# EAGLE design Bryan (EAGLE 6.4)
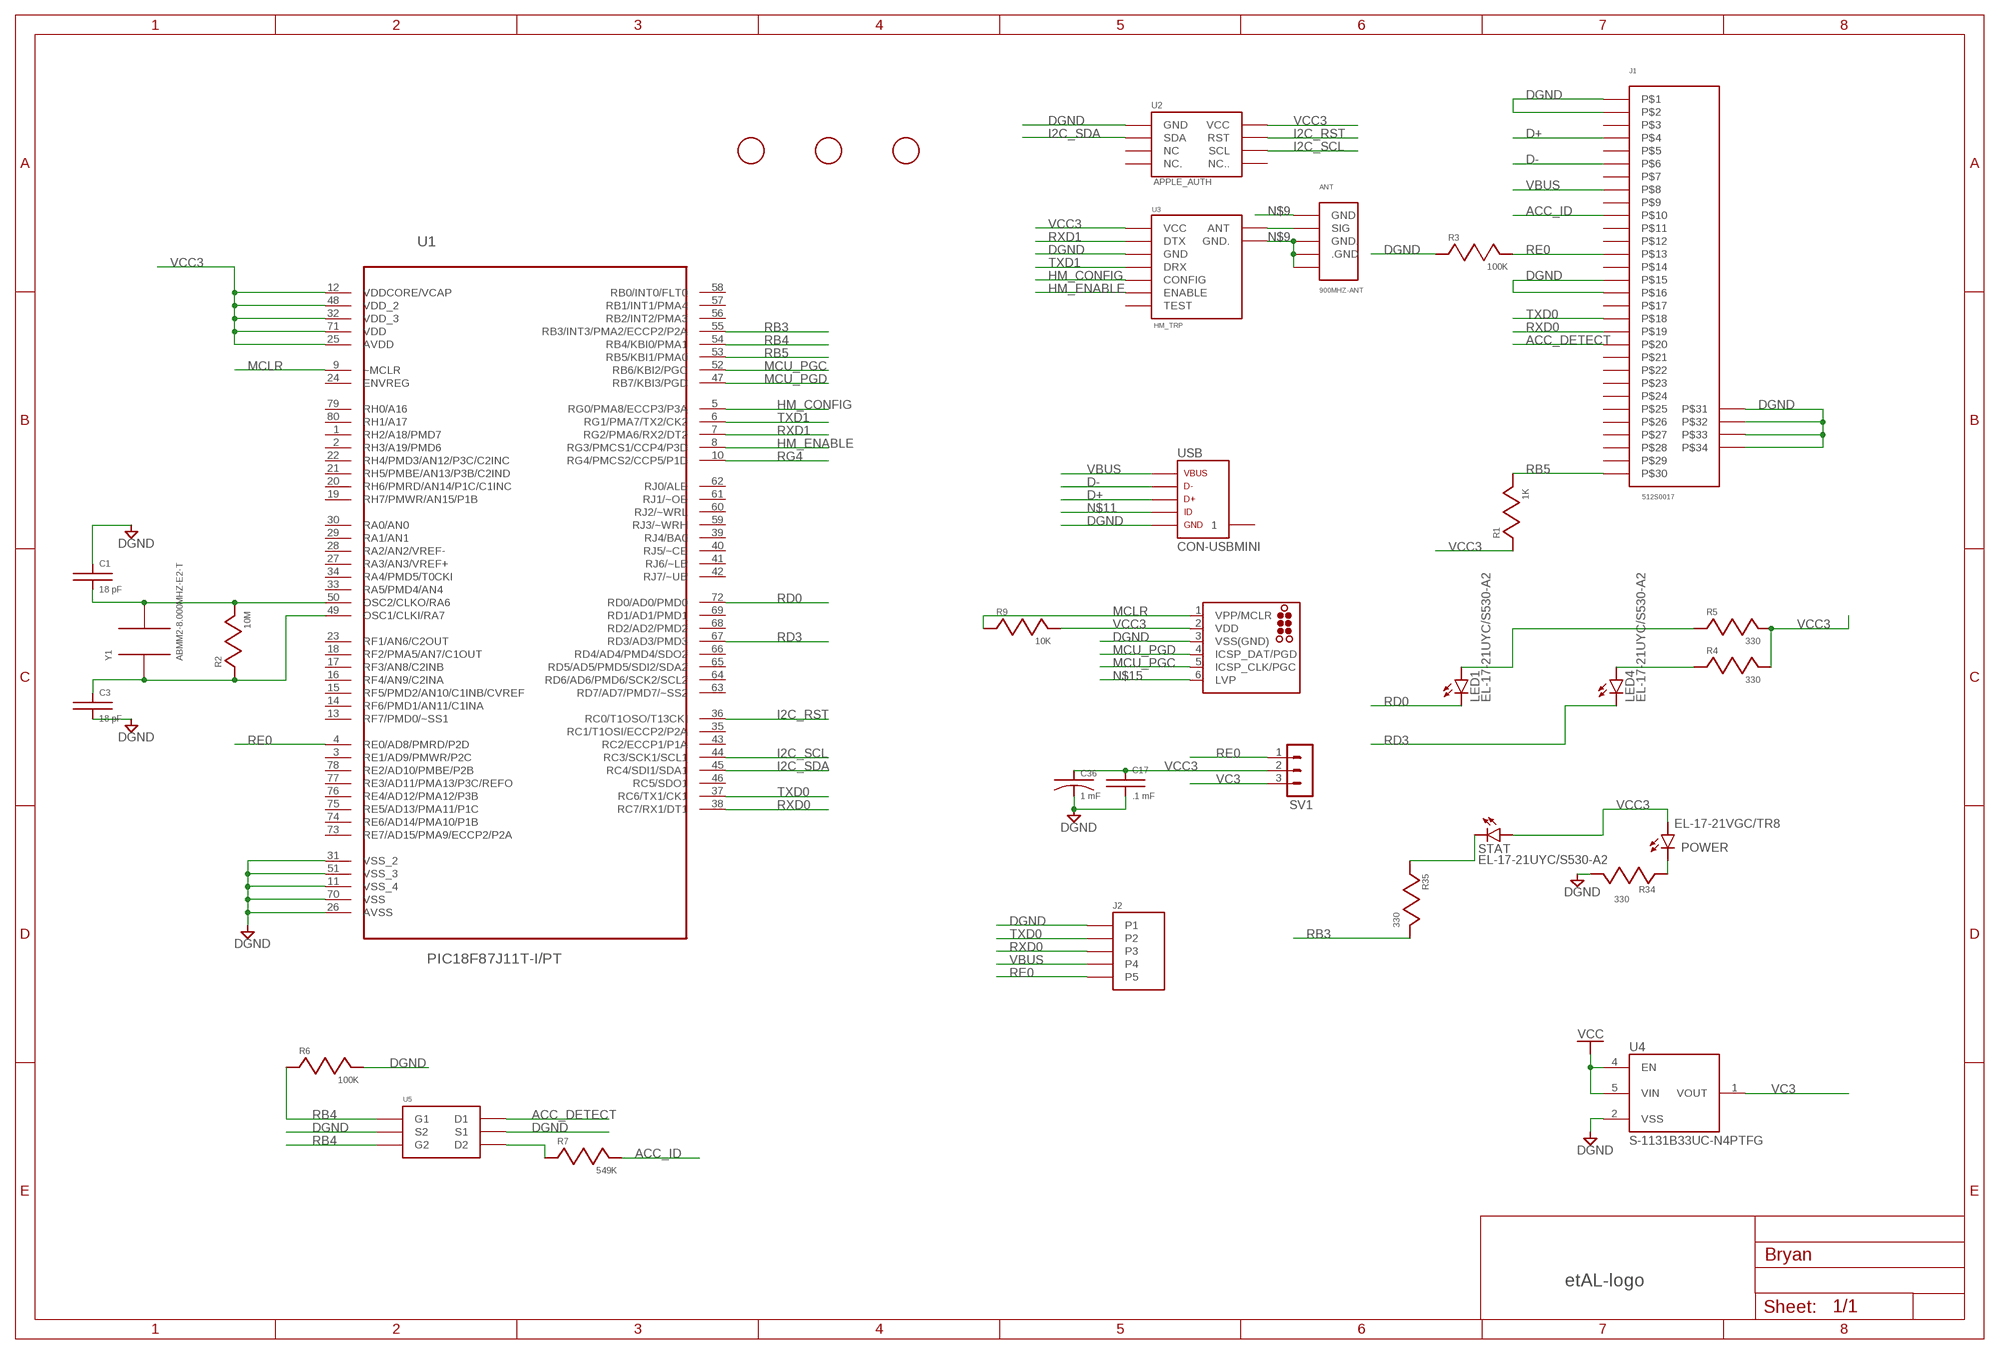
[diagram p0: schematic, sheet 1]

## Parts
ANT  900MHZ-ANT  [900MHZ-ANT]
C1  18 pF  C  [0603]
C3  18 pF  C  [0603]
C17  .1 mF  C  [0603]
C36  1 mF  C-POLAR1206  [1206-LONG]
J1  512S0017  [512S0017]
J2  LIGHTNING_C11  [LIGHTNING_C11]
J3  TC2030-MCP  [TC2030-MCP]
LED1  EL-17-21UYC/S530-A2  LED  [DIODE-0804]
LED4  EL-17-21UYC/S530-A2  LED  [DIODE-0804]
POWER  EL-17-21VGC/TR8  LED  [DIODE-0804]
R1  1K  R  [0603]
R2  10M  R  [0603]
R3  100K  R  [0603]
R4  330  R  [0603]
R5  330  R  [0603]
R6  100K  R  [0603]
R7  549K  R  [0603]
R9  10K  R  [0603]
R34  330  R  [0603]
R35  330  R  [0603]
STAT  EL-17-21UYC/S530-A2  LED  [DIODE-0804]
SV1  MA03-1  [MA03-1]
U1  PIC18F87J11T-I/PT  [QFP50P1400X1400X120-80N]
U2  APPLE_AUTH  [APPLE_AUTH]
U3  HM_TRP  [HM-TRP]
U4  S-1131B33UC-N4PTFG  S1131  [SOT-89-5]
U5  FDC6301N  [SUPER_SOT_6]
U$1  FIDUCIAL  [FIDUCIAL]
U$2  ETAL-LOGO  [ETAL-LOGO]
U$3  FIDUCIAL  [FIDUCIAL]
U$4  FIDUCIAL  [FIDUCIAL]
USB  CON-USBMINI  [USBMINI]
Y1  ABMM2-8.000MHZ-E2-T  CRYSTAL-ABMM  [CRYSTAL-6X3]

## Nets
ACC_DETECT: J1.P$20 U5.P$6(D1)
ACC_ID: J1.P$10 R7.2
D+: J1.P$4 USB.D+
D-: J1.P$6 USB.D-
DGND [POWER]: C1.1 C3.2 C17.2 C36.1(ANODE) J1.P$1 J1.P$2 J1.P$15 J1.P$16 J1.P$31 J1.P$32 J1.P$33 J1.P$34 J2.P1 J3.3(VSS(GND)) R3.1 R6.2 R34.2 U1.11(VSS_4) U1.26(AVSS) U1.31(VSS_2) U1.51(VSS_3) U1.70(VSS) U2.P$1(GND) U3.P3(GND) U4.2(VSS) U5.P$2(S2) U5.P$5(S1) USB.GND
HM_CONFIG: U1.5(RG0/PMA8/ECCP3/P3A) U3.P5(CONFIG)
HM_ENABLE: U1.8(RG3/PMCS1/CCP4/P3D) U3.P6(ENABLE)
I2C_RST: U1.36(RC0/T1OSO/T13CKI) U2.P$7(RST)
I2C_SCL: U1.44(RC3/SCK1/SCL1) U2.P$6(SCL)
I2C_SDA: U1.45(RC4/SDI1/SDA1) U2.P$2(SDA)
MCLR: J3.1(VPP/MCLR) R9.1 U1.9(~MCLR)
MCU_PGC: J3.5(ICSP_CLK/PGC) U1.52(RB6/KBI2/PGC)
MCU_PGD: J3.4(ICSP_DAT/PGD) U1.47(RB7/KBI3/PGD)
N$1 [extpwr]: ANT.P$2(SIG) U3.P9(ANT)
N$2: C1.2 R2.2 U1.50(OSC2/CLKO/RA6) Y1.P$3
N$3: LED1.CATHODE R5.1
N$4: C3.1 R2.1 U1.49(OSC1/CLKI/RA7) Y1.P$1
N$5: R35.1 STAT.ANODE
N$6: LED4.CATHODE R4.1
N$7: R7.1 U5.P$4(D2)
N$8: POWER.ANODE R34.1
N$9: ANT.P$1(.GND) ANT.P$3(GND.) ANT.P$4(GND) ANT.P$5 U3.P8(GND.)
N$11: USB.ID
N$15: J3.6(LVP)
RB3: R35.2 U1.55(RB3/INT3/PMA2/ECCP2/P2A)
RB4: R6.1 U1.54(RB4/KBI0/PMA1) U5.P$1(G1) U5.P$3(G2)
RB5: J1.P$30 R1.2 U1.53(RB5/KBI1/PMA0)
RD0: LED1.ANODE U1.72(RD0/AD0/PMD0)
RD3: LED4.ANODE U1.67(RD3/AD3/PMD3)
RE0: J1.P$13 J2.P5 R3.2 SV1.1 U1.4(RE0/AD8/PMRD/P2D)
RG4: U1.10(RG4/PMCS2/CCP5/P1D)
RXD0: J1.P$19 J2.P3 U1.38(RC7/RX1/DT1)
RXD1: U1.7(RG2/PMA6/RX2/DT2) U3.P2(DTX)
TXD0: J1.P$18 J2.P2 U1.37(RC6/TX1/CK1)
TXD1: U1.6(RG1/PMA7/TX2/CK2) U3.P4(DRX)
VBUS: J1.P$8 J2.P4 USB.VBUS
VC3 [extpwr]: SV1.3 U4.1(VOUT)
VCC [POWER]: U4.4(EN) U4.5(VIN)
VCC3 [POWER]: C17.1 C36.2(CATHODE) J3.2(VDD) POWER.CATHODE R1.1 R4.2 R5.2 R9.2 STAT.CATHODE SV1.2 U1.12(VDDCORE/VCAP) U1.25(AVDD) U1.32(VDD_3) U1.48(VDD_2) U1.71(VDD) U2.P$8(VCC) U3.P1(VCC)
Unconnected: J1.P$3 J1.P$5 J1.P$7 J1.P$9 J1.P$11 J1.P$12 J1.P$14 J1.P$17 J1.P$21 J1.P$22 J1.P$23 J1.P$24 J1.P$25 J1.P$26 J1.P$27 J1.P$28 J1.P$29 U1.1(RH2/A18/PMD7) U1.2(RH3/A19/PMD6) U1.3(RE1/AD9/PMWR/P2C) U1.13(RF7/PMD0/~SS1) U1.14(RF6/PMD1/AN11/C1INA) U1.15(RF5/PMD2/AN10/C1INB/CVREF) U1.16(RF4/AN9/C2INA) U1.17(RF3/AN8/C2INB) U1.18(RF2/PMA5/AN7/C1OUT) U1.19(RH7/PMWR/AN15/P1B) U1.20(RH6/PMRD/AN14/P1C/C1INC) U1.21(RH5/PMBE/AN13/P3B/C2IND) U1.22(RH4/PMD3/AN12/P3C/C2INC) U1.23(RF1/AN6/C2OUT) U1.24(ENVREG) U1.27(RA3/AN3/VREF+) U1.28(RA2/AN2/VREF-) U1.29(RA1/AN1) U1.30(RA0/AN0) U1.33(RA5/PMD4/AN4) U1.34(RA4/PMD5/T0CKI) U1.35(RC1/T1OSI/ECCP2/P2A) U1.39(RJ4/BA0) U1.40(RJ5/~CE) U1.41(RJ6/~LB) U1.42(RJ7/~UB) U1.43(RC2/ECCP1/P1A) U1.46(RC5/SDO1) U1.56(RB2/INT2/PMA3) U1.57(RB1/INT1/PMA4) U1.58(RB0/INT0/FLT0) U1.59(RJ3/~WRH) U1.60(RJ2/~WRL) U1.61(RJ1/~OE) U1.62(RJ0/ALE) U1.63(RD7/AD7/PMD7/~SS2) U1.64(RD6/AD6/PMD6/SCK2/SCL2) U1.65(RD5/AD5/PMD5/SDI2/SDA2) U1.66(RD4/AD4/PMD4/SDO2) U1.68(RD2/AD2/PMD2) U1.69(RD1/AD1/PMD1) U1.73(RE7/AD15/PMA9/ECCP2/P2A) U1.74(RE6/AD14/PMA10/P1B) U1.75(RE5/AD13/PMA11/P1C) U1.76(RE4/AD12/PMA12/P3B) U1.77(RE3/AD11/PMA13/P3C/REFO) U1.78(RE2/AD10/PMBE/P2B) U1.79(RH0/A16) U1.80(RH1/A17) U2.P$3(NC) U2.P$4(NC.) U2.P$5(NC..) U3.P7(TEST) USB.P$1

## Library data of the parts
ANT = bgsystems:900MHZ-ANT
C1 C3 C17 = bgsystems:C: CAPACITOR
C36 = bgsystems:C-POLAR
J1 = bgsystems:512S0017
J2 = bgsystems:LIGHTNING_C11
J3 = BrandWatch:TC2030: TAG-CONNECT ISP Connector Manufacturer: Tag-Connect <www.tag-connect.com> Cable for easy In-Circuit PCB Programming. Designed for Microchip ICD2, suitable for many others. Two variants - one "with legs" (for hads-free fit on PCB) and another "without legs" for quick programming. PAD Description 1 MCLR/Vpp 2 Vdd 3 GND 4 PGD (ISPDAT) 5 PGC (ISPCLK) 6 nc (used for LVP) ©2009 ROFA.cz
LED1 LED4 POWER STAT = bgsystems:LED: LED - Kingbright SUPER FLUX LED LAMP Source: www.us.kingbright.com/images/catalog/SPEC/W7676CPBC-H.pdf
R1-R7 R9 R34 R35 = bgsystems:R
SV1 = con-lstb:MA03-1: PIN HEADER; OC_FARNELL: unknown; OC_NEWARK: unknown
U1 = microchip_1:PIC18F87J11T-I/PT: IC PIC MCU; MPN: PIC18F87J11T-I/PT; OC_FARNELL: 1439570; OC_NEWARK: 59M1138; PACKAGE: QFP-80; SUPPLIER: Microchip
U2 = bgsystems:APPLE_AUTH
U3 = bgsystems:HM_TRP
U4 = bgsystems:S1131
U5 = bgsystems:FDC6301N
U$1 U$3 U$4 = bgsystems:FIDUCIAL
U$2 = bgsystems:ETAL-LOGO
USB = bgsystems:CON-USBMINI
Y1 = bgsystems:CRYSTAL-ABMM

## Net classes
0 default: width 0.203 mm
1 POWER: width 0.203 mm
2 ADC: width 0.203 mm
3 extpwr: width 0.889 mm
4 AGND: width 0.356 mm

## Board
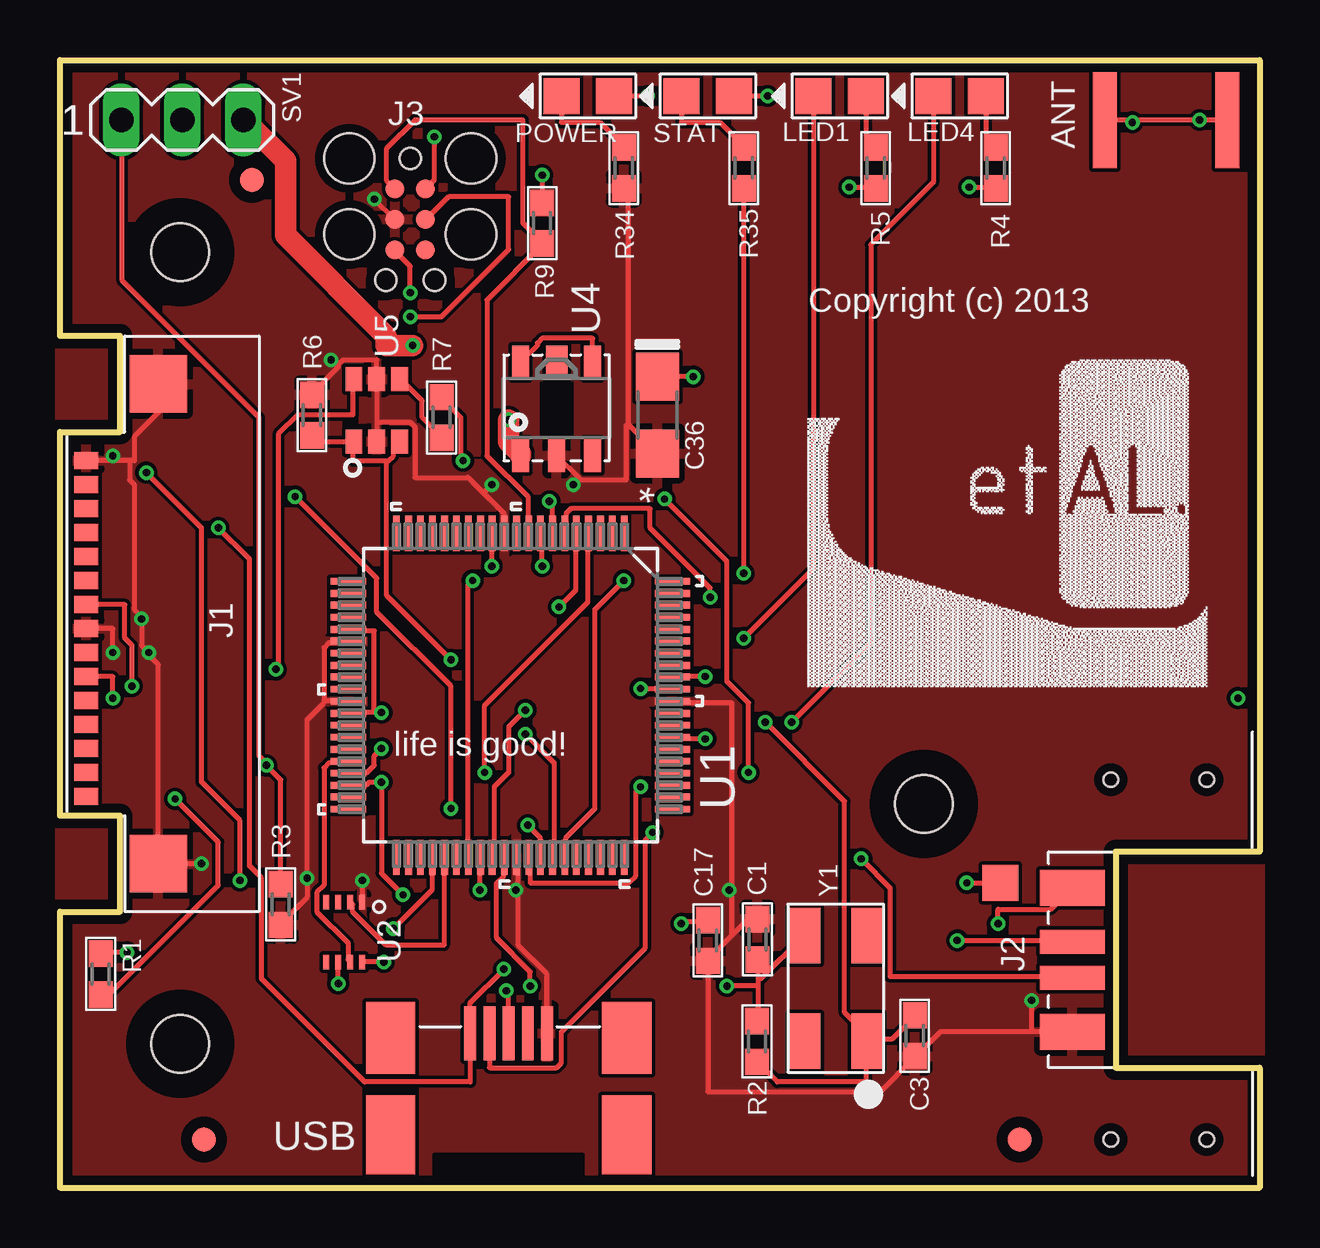
[diagram p1: board, top side]
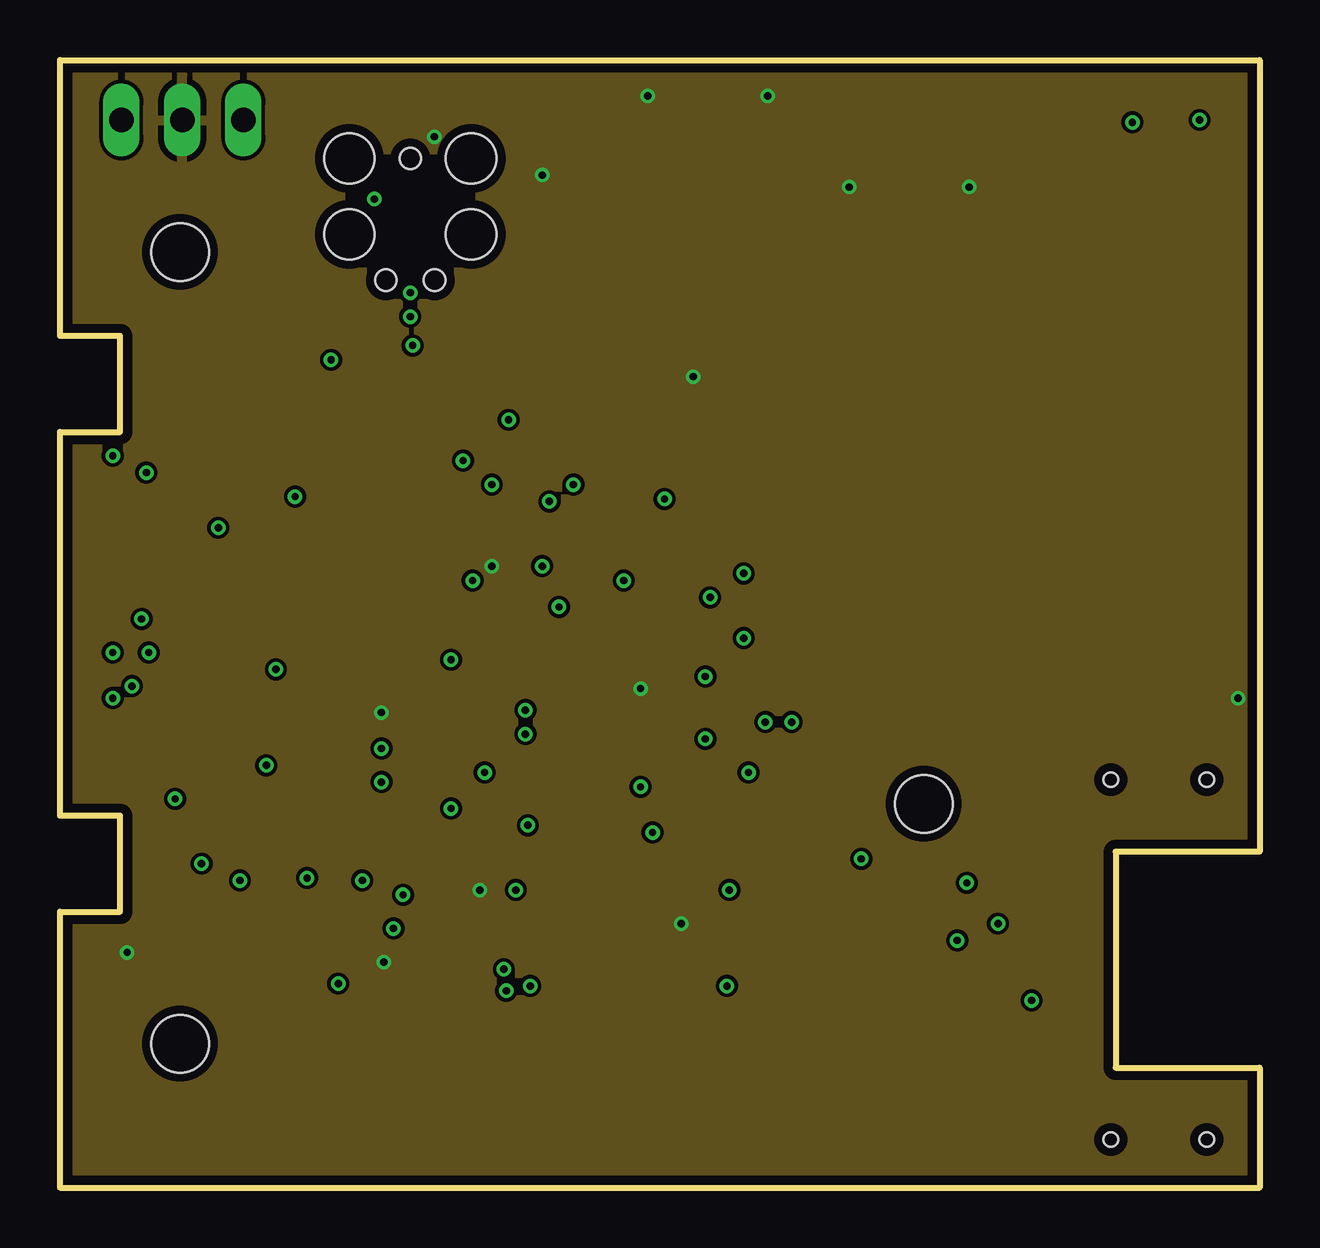
[diagram p2: board, inner layer PWR]
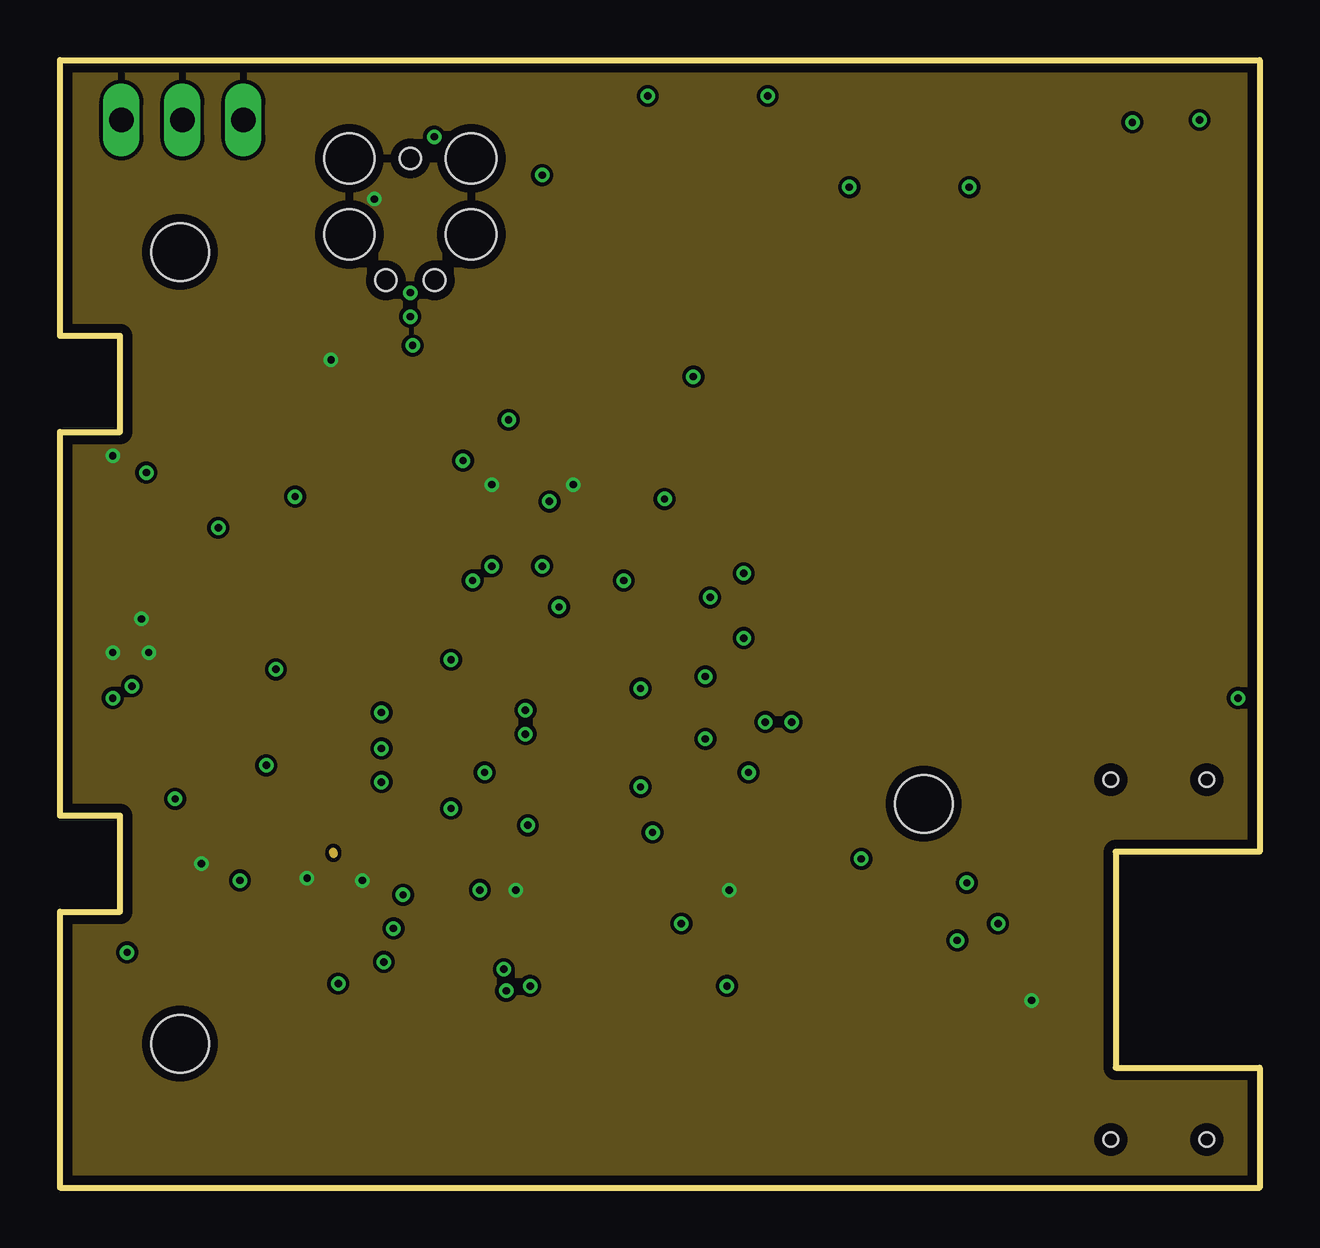
[diagram p3: board, inner layer GND]
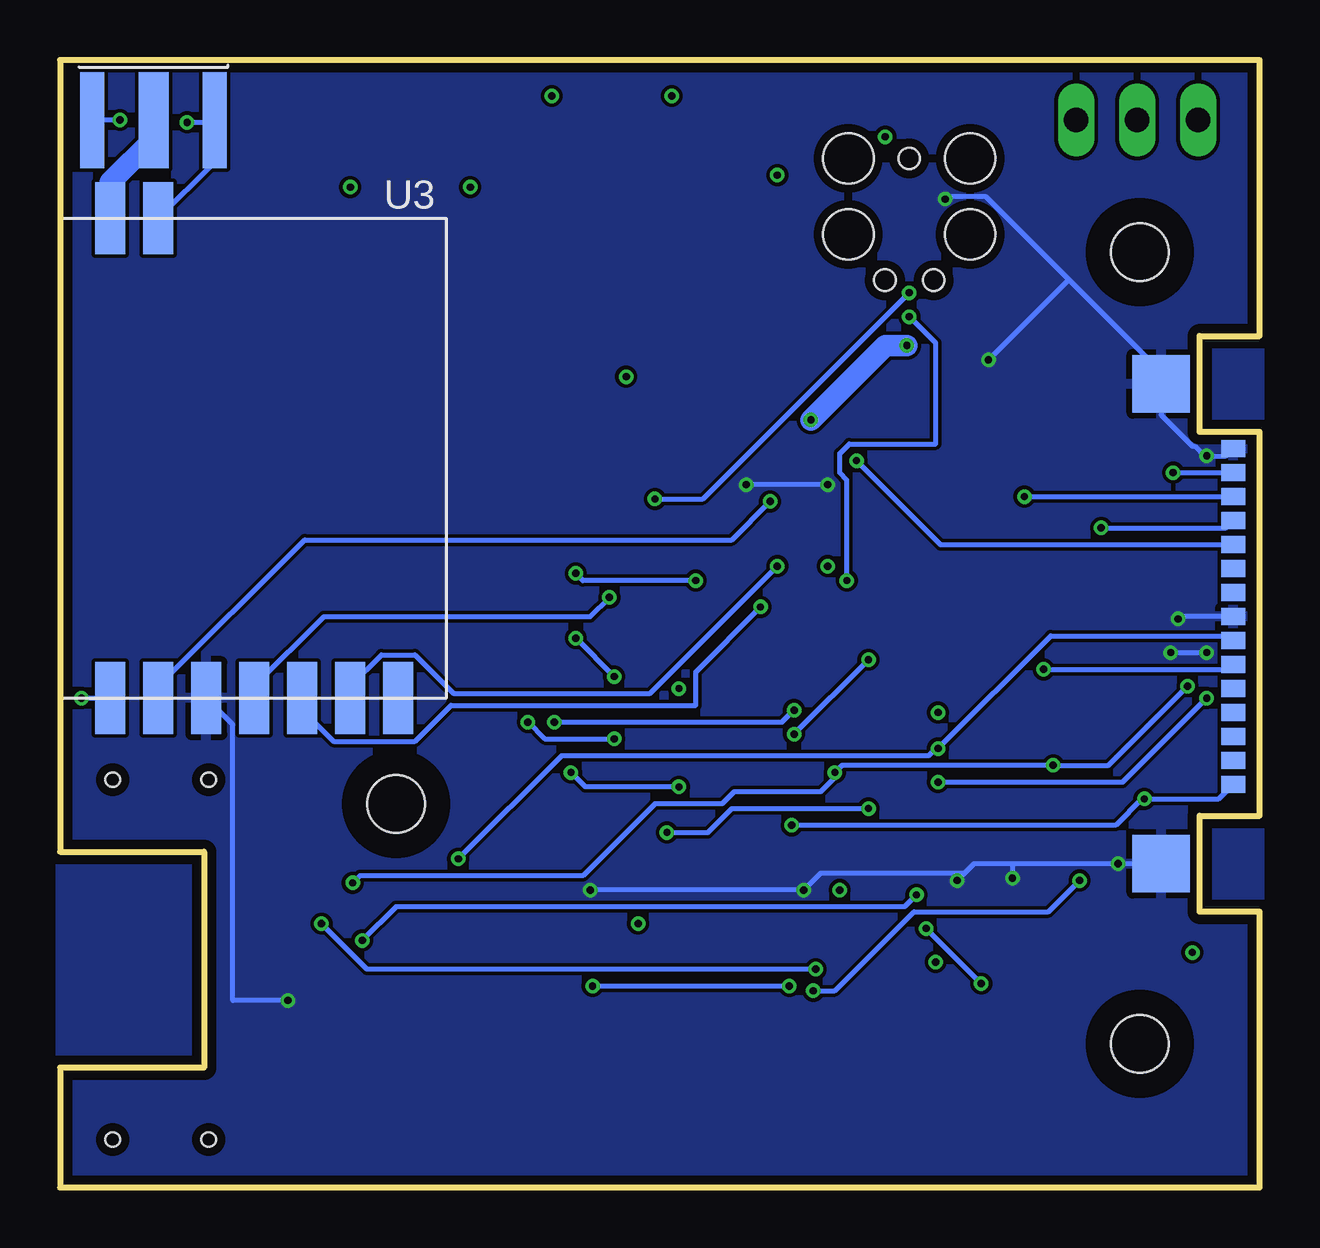
[diagram p4: board, bottom side, seen from below]

Size 50 x 47 mm. Coordinates in mm from the lower left corner, seen from the top.
Outline: 0,0 50,0 50,5 44,5 44,14 50,14 50,47 0,47 0,35.5 2.5,35.5 2.5,31.5 0,31.5 0,15.5 2.5,15.5 2.5,11.5 0,11.5 0,0
Copper layers (1*3+14*16): Top 0.035mm / dielectric 0.2mm / PWR 0.035mm / dielectric 0.2mm / GND 0.035mm / dielectric 0.15mm / Bottom 0.035mm
Design rules "default": minimum track width 8mil, minimum drill 12mil, track to track 6mil, track to pad 6mil, pad to pad 6mil, via to via 10mil, smd to smd 5mil, copper to edge 15mil, drill to drill 7mil, minimum pad ring 0.25mm, minimum via ring 0.15mm, stop-mask expansion 0.1mm, vias tented up to drill 24mil, thermal gap 0.25mm
Holes 2.4 mm at 36,16 5,6 5,39
tRestrict: area 54.2,25.3 to 58.1,29.2; area 63.1,41.6 to 67.1,45.6; area 53.1,9.6 to 57.1,13.6; area 3.2,37.2 to 6.8,40.8; area 3.2,4.2 to 6.8,7.8; area 34.2,14.2 to 37.8,17.8
bRestrict: area 56.1,30.2 to 60.2,34.3; area 72.1,37.6 to 76.1,41.6; area 53.1,17.6 to 57.1,21.6; area 3.2,37.2 to 6.8,40.8; area 3.2,4.2 to 6.8,7.8; area 34.2,14.2 to 37.8,17.8

### Footprints (pad centres in the part's own frame; a part is rotated, then mirrored left to right if it is on the bottom)
900MHZ-ANT = smd 1 x 4: P$1 -2.55,0; P$3 2.55,0 | smd 1.25 x 4: P$2 0,0 | smd 1 x 4 bottom: P$4 -2.55,0; P$5 2.55,0
0603 = smd 1.1 x 1: 1 -0.85,0; 2 0.85,0
1206-LONG = smd 2 x 1.8: 1 -1.6,0; 2 1.6,0
512S0017 = smd 0.7 x 1: P$1 -6.8,0.8; P$3 -5.8,0.8; P$5 -4.8,0.8; P$7 -3.8,0.8; P$9 -2.8,0.8; P$11 -1.8,0.8; P$13 -0.8,0.8; P$15 0.2,0.8; P$17 1.2,0.8; P$19 2.2,0.8; P$21 3.2,0.8; P$23 4.2,0.8; P$25 5.2,0.8; P$27 6.2,0.8; P$29 7.2,0.8 | smd 0.7 x 1 bottom: P$2 -7.3,0.8; P$4 -6.3,0.8; P$6 -5.3,0.8; P$8 -4.3,0.8; P$10 -3.3,0.8; P$12 -2.3,0.8; P$14 -1.3,0.8; P$16 -0.3,0.8; P$18 0.7,0.8; P$20 1.7,0.8; P$22 2.7,0.8; P$24 3.7,0.8; P$26 4.7,0.8; P$28 5.7,0.8; P$30 6.7,0.8 | smd 2.4 x 2.4: P$31 10,3.8; P$32 -10,3.8 | smd 2.4 x 2.4 bottom: P$33 -10,3.8; P$34 10,3.8
LIGHTNING_C11 = smd 1.5 x 2.7: P1 3,1; P4 -3,1 | smd 1 x 2.7: P2 0.75,1; P3 -0.75,1 | smd 1.5 x 1.5: P5 -3.2,-2 | hole 0.6: -7.5,6.6; -7.5,2.6; 7.5,6.6; 7.5,2.6
TC2030-MCP = smd 0.787 x 0.787: 1 1.27,-0.635; 2 1.27,0.635; 3 2.54,-0.635; 4 2.54,0.635; 5 3.81,-0.635; 6 3.81,0.635 | hole 0.889: 0,0; 5.08,-1.016; 5.08,1.016 | hole 2.1: 0,2.54; 0,-2.54; 3.175,-2.54; 3.175,2.54
DIODE-0804 = smd 1.5 x 1.5: ANODE -1.1,0; CATHODE 1.1,0
MA03-1 = drill 1.016 long: 1 -2.54,0; 2 0,0; 3 2.54,0
QFP50P1400X1400X120-80N = smd 1.473 x 0.279: 1 -6.756,4.75; 2 -6.756,4.242; 3 -6.756,3.759; 4 -6.756,3.251; 5 -6.756,2.743; 6 -6.756,2.261; 7 -6.756,1.753; 8 -6.756,1.245; 9 -6.756,0.762; 10 -6.756,0.254; 11 -6.756,-0.254; 12 -6.756,-0.762; 13 -6.756,-1.245; 14 -6.756,-1.753; 15 -6.756,-2.261; 16 -6.756,-2.743; 17 -6.756,-3.251; 18 -6.756,-3.759; 19 -6.756,-4.242; 20 -6.756,-4.75; 41 6.756,-4.75; 42 6.756,-4.242; 43 6.756,-3.759; 44 6.756,-3.251; 45 6.756,-2.743; 46 6.756,-2.261; 47 6.756,-1.753; 48 6.756,-1.245; 49 6.756,-0.762; 50 6.756,-0.254; 51 6.756,0.254; 52 6.756,0.762; 53 6.756,1.245; 54 6.756,1.753; 55 6.756,2.261; 56 6.756,2.743; 57 6.756,3.251; 58 6.756,3.759; 59 6.756,4.242; 60 6.756,4.75 | smd 0.279 x 1.473: 21 -4.75,-6.756; 22 -4.242,-6.756; 23 -3.759,-6.756; 24 -3.251,-6.756; 25 -2.743,-6.756; 26 -2.261,-6.756; 27 -1.753,-6.756; 28 -1.245,-6.756; 29 -0.762,-6.756; 30 -0.254,-6.756; 31 0.254,-6.756; 32 0.762,-6.756; 33 1.245,-6.756; 34 1.753,-6.756; 35 2.261,-6.756; 36 2.743,-6.756; 37 3.251,-6.756; 38 3.759,-6.756; 39 4.242,-6.756; 40 4.75,-6.756; 61 4.75,6.756; 62 4.242,6.756; 63 3.759,6.756; 64 3.251,6.756; 65 2.743,6.756; 66 2.261,6.756; 67 1.753,6.756; 68 1.245,6.756; 69 0.762,6.756; 70 0.254,6.756; 71 -0.254,6.756; 72 -0.762,6.756; 73 -1.245,6.756; 74 -1.753,6.756; 75 -2.261,6.756; 76 -2.743,6.756; 77 -3.251,6.756; 78 -3.759,6.756; 79 -4.242,6.756; 80 -4.75,6.756
APPLE_AUTH = smd 0.25 x 0.6: P$1 -0.7,-1.2; P$2 -0.2,-1.2; P$3 0.3,-1.2; P$4 0.8,-1.2; P$5 0.8,1.3; P$6 0.3,1.3; P$7 -0.2,1.3; P$8 -0.7,1.3
HM-TRP = smd 1.25 x 3: P1 2,0; P2 4,0; P3 6,0; P4 8,0; P5 10,0; P6 12,0; P7 14,0; P8 4,20; P9 2,20
SOT-89-5 = smd 0.7 x 1.4: 1 -1.499,-1.981; 2 0,-1.981; 3 1.499,-1.981; 4 1.5,1.9; 5 -1.5,1.9 | smd 0.9 x 1.4: 2.1 0,1.9
SUPER_SOT_6 = smd 0.7 x 1: P$1 -0.95,-1.3; P$2 0,-1.3; P$3 0.95,-1.3; P$4 0.95,1.3; P$5 0,1.3; P$6 -0.95,1.3
FIDUCIAL = smd 1 x 1: P$1 0,0
USBMINI = smd 2.25 x 0.5: D+ 6.225,0; D- 6.225,0.8; GND 6.225,-1.6; ID 6.225,-0.8; VBUS 6.225,1.6 | smd 3 x 2.05: P$1 6.05,-4.925; P$2 6.05,4.925 | smd 3.3 x 2.05: P$3 2,4.925; P$4 2,-4.925
CRYSTAL-6X3 = smd 2.3 x 1.3: P$1 -2.2,-1.3; P$2 2.2,-1.3; P$3 2.2,1.3; P$4 -2.2,1.3

### Placement (x,y rotation side)
ANT  46.1,44.5 0 bottom
C1  29.07,10.35 270 top
C3  35.63,6.33 270 top
C17  27,10.3 270 top
C36  24.9,32.2 90 top
J1  0.3,23.5 270 top
J2  41.2,9.5 270 top
J3  14.6,42.9 270 top
LED1  32.5,45.5 0 top
LED4  37.5,45.5 0 top
POWER  22,45.5 0 top
R1  1.7,8.9 270 top
R2  29.05,6.09 90 top
R3  9.2,11.8 90 top
R4  39,42.5 270 top
R5  34,42.5 270 top
R6  10.5,32.2 90 top
R7  15.9,32.1 90 top
R9  20.1,40.2 90 top
R34  23.5,42.5 270 top
R35  28.5,42.5 270 top
STAT  27,45.5 0 top
SV1  5.1,44.5 0 top
U1  18.78,20.52 270 top
U2  11.9,10.7 180 top
U3  49.9,20.4 0 bottom
U4  20.7,32.5 0 top
U5  13.2,32.4 0 top
U$1  8,42 0 top
U$2  31.2,20.9 0 top
U$3  6,2 0 top
U$4  40,2 0 top
USB  18.7,0.2 90 top
Y1  32.34,8.3 90 top

### Tracks (layer width: path | path; a pad name or v marks a point on that pad's centre or on a via)
ACC_DETECT  (via drill 0.3)
  Top 0.203: v9,21.6 9.1,21.7 9.1,31.4 9.9,32.2 12.2,32.2 12.2,33.7 U5.P$6
  Bottom 0.203: J1.P$20 1.3,21.6 v9,21.6
ACC_ID  (via drill 0.3)
  Top 0.203: v16.8,30.3 16.7,30.4 16.7,32.1 15.9,32.9 R7.2
  Bottom 0.203: J1.P$10 13.3,26.8 v16.8,30.3
AGND
  GND 0.356: 11.4,13.9 11.39,14
D+  (via drill 0.3)
  Top 0.203: v3.6,29.8 5.9,27.5 5.9,16.9 7.5,15.3 v7.5,12.8 | v18.6,8.2 18.7,8.1 USB.D+
  Bottom 0.203: v3.6,29.8 J1.P$4 | v7.5,12.8 8.8,11.5 14.4,11.5 17.7,8.2 v18.6,8.2
D-  (via drill 0.3)
  Top 0.203: v9.8,28.8 13.2,25.4 13.2,24 16.3,20.9 v16.3,15.8 | v24.7,14.8 24.4,14.5 24.4,10 20.9,6.5 20.9,5.2 20.7,5 17.9,5 USB.D-
  Bottom 0.203: v9.8,28.8 J1.P$6 | v16.3,15.8 22,15.8 23,14.8 v24.7,14.8
DGND  (via drill 0.3)
  Top 0.203: 23.7,31.8 23.7,41.4 23.5,41.6 R34.2 | C36.1 23.7,31.8 | 21.65,29.55 21.7,29.5 23.6,29.5 23.6,31.8 23.7,31.8 | 21.65,29.55 20.7,30.5 U4.2 | J1.P$15 2.2,23.3 v2.2,22.3 | 2.9,30.3 3.1,30.3 3.1,31.3 4.1,32.3 J1.P$33 | 2.9,30.3 2.2,30.3 | 2.2,30.3 J1.P$1 | v2.2,30.5 2.2,30.3 | 2.9,30.3 2.9,29.5 3.1,29.3 3.1,24.1 3.4,23.8 v3.4,23.7 3.4,22.6 v3.7,22.3 3.7,22.2 4.1,21.8 J1.P$34 v5.9,13.5 | 13.2,31.9 U5.P$5 13.2,34.5 11.8,34.5 11.6,34.3 | 13.2,31.9 U5.P$2 | 11.6,34.3 11.6,34.2 10.5,33.1 R6.2 | 17.65,28.95 17,29.6 14.8,29.6 14.8,31.7 14.6,31.9 13.2,31.9 | 17.65,28.95 18.5,28.1 18.5,27.3 U1.11 | v13.1,41.2 13.9,40.4 J3.3 | v11.3,34.5 11.5,34.3 11.6,34.3 | v21.4,29.3 21.65,29.55 | 17.65,28.95 v18,29.3 | J2.P1 40.5,6.5 | 40.5,6.5 36.7,6.5 35.7,5.5 C3.2 35.6,5.4 34.2,4 27,4 C17.2 27,9.5 28.05,10.55 | 40.5,6.5 v40.5,7.8 | 28.05,10.55 28.6,11.1 29,11.1 C1.1 | 28,12.4 28,10.6 28.05,10.55 | 28,12.4 28,20.2 25.6,20.2 U1.70 | 19.1,12.4 19.1,10.1 20.3,8.9 USB.GND | 19.1,12.4 19.1,13.7 U1.51 | 11,20.3 12,20.3 U1.31 | 11,20.3 11,22.5 11.2,22.7 12,22.7 U1.26 | v12.6,12.8 U2.P$1 | R3.1 9.2,11 10.3,12.1 v10.3,12.9 10.3,19.5 11,20.2 11,20.3 | v19,12.4 19.1,12.4 | v27.9,12.4 28,12.4
  Bottom 0.203: v3.7,22.3 v2.2,22.3 | v3.4,23.7 3.3,23.8 J1.P$16 | J1.P$2 1.4,30.5 v2.2,30.5 2.3,30.5 2.7,30.9 2.8,30.9 4.1,32.2 J1.P$33 4.1,34 7.95,37.85 | v13.1,41.2 13,41.3 11.4,41.3 7.95,37.85 | 7.95,37.85 v11.3,34.5 | v18,29.3 v21.4,29.3 | U3.P3 42.8,19.3 42.8,7.8 v40.5,7.8 | 12.35,13.05 11.9,13.5 10.3,13.5 | 12.35,13.05 v12.6,12.8 | J1.P$34 v5.9,13.5 10.3,13.5 | 10.3,13.5 v10.3,12.9 | 12.35,13.05 12.4,13.1 18.3,13.1 v19,12.4 v27.9,12.4
  pour GND (rank 5): 50,0 50,47 -0.17,47 0,32.5 0.31,7.97 0,0
  pour Top: 0,0 0,47 50,47 50,0
  pour Bottom: 0,0 0,47 50,47 50,0
HM_CONFIG  (via drill 0.3)
  Top 0.203: v20.8,24.2 21.5,24.9 21.5,27.2 U1.5
  Bottom 0.203: v20.8,24.2 23.5,21.5 23.5,20.1 33.7,20.1 35.2,18.6 38.6,18.6 39.9,19.9 U3.P5
HM_ENABLE  (via drill 0.3)
  Top 0.203: v20.1,25.9 20.1,27.2 U1.8
  Bottom 0.203: v20.1,25.9 25.4,20.6 33.6,20.6 35.2,22.2 36.6,22.2 37.9,20.9 U3.P6
I2C_RST
  Top 0.203: U2.P$7 12,9.5 12,10.2 10.7,11.5 10.7,12.3 11,12.6 11,17.5 11.2,17.7 12,17.7 U1.36
I2C_SCL  (via drill 0.3)
  Top 0.203: v11.6,8.5 U2.P$6 | v13.9,10.8 15.5,12.4 15.5,13.7 U1.44
  Bottom 0.203: v13.9,10.8 v11.6,8.5
I2C_SDA
  Top 0.203: U2.P$2 12.2,11.8 12.2,11.5 13.6,10.1 16,10.1 16,13.7 U1.45
MCLR
  Top 0.203: J3.1 13.9,41.7 13.6,42 13.6,43.3 14.8,44.5 19.3,44.5 19.3,40.2 20.1,39.4 R9.1 20.1,39.3 17.8,37 17.8,30.5 19.5,28.8 19.5,27.3 U1.9
MCU_PGC  (via drill 0.3)
  Top 0.203: v14.6,37.3 14.6,38.4 14,39 J3.5 | v25.2,28.7 27.8,26.1 27.8,21.1 28.7,20.2 v28.7,17.3 | v24.2,16.7 24,16.5 24,13 23.7,12.7 19.6,12.7 19.6,13.7 U1.52
  Bottom 0.203: v14.6,37.3 23.2,28.7 v25.2,28.7 | v28.7,17.3 28.1,16.7 v24.2,16.7
MCU_PGD  (via drill 0.3)
  Top 0.203: v14.6,36.3 15.9,36.3 18.7,39.1 18.7,41.3 16.2,41.3 15.3,40.4 J3.4 | v17.2,25.3 17,25.1 17,13.8 U1.47
  Bottom 0.203: v14.6,36.3 13.5,35.2 13.5,31 17.1,31 17.5,30.6 17.5,29.8 17.2,29.5 v17.2,25.3
N$1
  Bottom 0.889: U3.P9 47.9,41.9 46.1,43.7 ANT.P$2
N$2  (via drill 0.3)
  Top 0.203: 29.1,8.7 29.1,9.4 C1.2 | 29.1,8.7 29.1,8.4 | 29.1,8.4 29.1,7 R2.2 | v19.6,8.4 19.6,9 18.2,10.4 18.2,12.7 18.5,13 18.5,13.7 U1.50 | 29.1,8.4 v27.8,8.4 | Y1.P$3 31,10.5 29.2,8.7 29.1,8.7
  Bottom 0.203: v27.8,8.4 v19.6,8.4
N$3
  Top 0.203: LED1.CATHODE 33.6,43.8 34,43.4 R5.1
N$4  (via drill 0.3)
  Top 0.203: R2.1 29.1,5.2 29.9,4.4 33.6,4.4 33.6,6.1 Y1.P$1 | C3.1 35.6,7.1 34.7,6.2 33.7,6.2 Y1.P$1 | v19.4,19.9 18.7,19.2 18.7,17.3 18.1,16.7 18.1,13.8 U1.49 | v29.4,19.4 32.7,16.1 32.7,7.3 33.7,6.3 Y1.P$1
  Bottom 0.203: v19.4,19.9 19.9,19.4 v29.4,19.4
N$5
  Top 0.203: STAT.ANODE 25.9,44.4 27.5,44.4 28.5,43.4 R35.1
N$6
  Top 0.203: LED4.CATHODE 38.6,43.8 39,43.4 R4.1
N$7
  Top 0.203: U5.P$4 14.2,33.7 15.1,32.8 15.1,32.1 15.9,31.3 R7.1
N$8
  Top 0.203: POWER.ANODE 20.9,44.4 22.5,44.4 23.5,43.4 R34.1
N$9  (via drill 0.3)
  Top 0.203: ANT.P$1 v47.5,44.5 44.7,44.5 | 44.7,44.5 ANT.P$5 | v44.7,44.4 44.7,44.5
  Bottom 0.203: U3.P8 43.6,42.7 43.6,44.5 ANT.P$5 43.7,44.4 v44.7,44.4 | v47.5,44.5 ANT.P$1
RB3  (via drill 0.3)
  Top 0.203: v28.5,25.6 R35.2 | v23.5,25.3 22.3,24.1 22.3,15.8 21.1,14.6 21.1,13.8 U1.55
  Bottom 0.203: v28.5,25.6 28.2,25.3 v23.5,25.3
RB4  (via drill 0.3)
  Top 0.203: R6.1 10.5,31.1 U5.P$1 12.2,31 12.2,30.3 13.6,30.3 | 13.6,30.3 13.7,30.3 13.9,30.5 13.9,30.9 14.1,31.1 U5.P$3 | v19.4,18.9 20.6,17.7 20.6,13.8 U1.54 | v16.3,22 13.6,24.7 13.6,30.3
  Bottom 0.203: v16.3,22 v19.4,18.9
RB5  (via drill 0.3)
  Top 0.203: v4.8,16.2 6.6,14.4 6.6,12.6 2.1,8.1 1.7,8.1 R1.2 | v19.5,15.1 20,14.6 20,13.8 U1.53
  Bottom 0.203: J1.P$30 1.7,16.2 v4.8,16.2 4.9,16.2 6,15.1 v19.5,15.1
RD0  (via drill 0.3)
  Top 0.203: v26.9,21.3 25.6,21.3 U1.72 | v28.5,22.9 31.4,25.8 LED1.ANODE
  Bottom 0.203: v28.5,22.9 v26.9,21.3
RD3  (via drill 0.3)
  Top 0.203: v26.9,18.7 25.6,18.7 U1.67 | v30.5,19.4 33.8,22.7 33.8,39.3 36.4,41.9 LED4.ANODE
  Bottom 0.203: v26.9,18.7 29.8,18.7 v30.5,19.4
RE0  (via drill 0.3)
  Top 0.203: J1.P$13 2.7,24.3 2.7,22.9 3,22.6 v3,20.9 | R3.2 9.2,17 v8.6,17.6 8.6,17.7 8.3,18 8.3,32.1 2.6,37.8 2.6,44.5 SV1.1 | v17.7,17.3 17.7,20.1 22,24.4 22,27.2 U1.4 | v37.8,12.7 J2.P5
  Bottom 0.203: v3,20.9 6.3,17.6 v8.6,17.6 17.4,17.6 v17.7,17.3 17.7,17.1 18.3,16.5 21.9,16.5 22.4,16 25.2,16 28.2,13 37.5,13 v37.8,12.7
RXD0  (via drill 0.3)
  Top 0.203: J1.P$19 2.2,21.3 v2.2,20.4 | U1.38 12.1,16.8 12.8,16.8 12.9,16.9 v13.4,16.9 13.4,13.1 v14.3,12.2 | v37.4,10.3 42.2,10.3 J2.P3
  Bottom 0.203: v2.2,20.4 5.7,16.9 v13.4,16.9 | v37.4,10.3 36,11.7 14.8,11.7 v14.3,12.2
RXD1  (via drill 0.3)
  Top 0.203: v20.4,28.6 20.5,28.5 20.5,27.3 U1.7
  Bottom 0.203: v20.4,28.6 22,27 39.8,27 45.9,20.9 U3.P2
TXD0  (via drill 0.3)
  Top 0.203: v13.4,18.3 13.1,18 13.1,17.6 12.8,17.3 12.1,17.3 U1.37 | v33.4,13.7 34.6,12.5 34.6,8.8 42.2,8.8 J2.P2
  Bottom 0.203: J1.P$18 1.3,23 8.7,23 v13.4,18.3 13.5,18.3 13.8,18 29.1,18 v33.4,13.7
TXD1  (via drill 0.3)
  Top 0.203: v27.1,24.6 27.1,25 24.6,27.5 24.6,28.3 21.3,28.3 21.1,28.1 21.1,27.3 U1.6
  Bottom 0.203: v27.1,24.6 27.9,23.8 39,23.8 41.9,20.9 U3.P4
VBUS  (via drill 0.3)
  Top 0.203: v6.6,27.5 7.9,26.2 7.9,13.4 8.4,12.9 8.4,8.7 12.7,4.4 17.1,4.4 USB.VBUS 17.1,7.7 v18.5,9.1 | J2.P4 41.3,11.6 39.1,11.6 v39.1,11
  Bottom 0.203: J1.P$8 1.4,27.5 v6.6,27.5 | v39.1,11 37.2,9.1 v18.5,9.1
VC3  (via drill 0.3)
  Top 0.889: v18.7,32 18.7,31.1 19.2,30.6 U4.1 | v14.7,35.1 13.6,35.1 13.6,35.5 9.4,39.7 9.4,42.8 7.7,44.5 SV1.3
  Bottom 0.889: v18.7,32 15.6,35.1 v14.7,35.1
VCC
  Top 0.203: U4.5 19.9,35.1 19.9,35.2 20.1,35.4 22.2,35.4 U4.4
VCC3  (via drill 0.3)
  Top 0.203: v13.5,9.4 U2.P$8 | v15.6,43.8 15.6,42 15.3,41.7 J3.2 | v2.8,9.8 1.7,9.8 R1.1 | v25.9,11 25.9,11.1 27,11.1 C17.1 | v20.1,42.2 R9.2 | v32.9,41.7 34,41.7 R5.2 | v37.9,41.7 39,41.7 R4.2 | U1.32 12.1,19.8 v13.4,19.8 13.1,19.9 13.1,23.2 12.1,23.2 U1.25 | v17.5,12.4 17.5,13.7 U1.48 | v18,25.9 18,27.2 U1.12 | v24.2,20.8 25.5,20.8 U1.71 | v24.5,45.5 POWER.CATHODE | v29.5,45.5 STAT.CATHODE | v26.4,33.8 C36.2
  Bottom 0.203: v49.1,20.4 U3.P1
  pour PWR: 0,47 50,47 50,0 0.05,0.12

### Text on the board
tPlace: Copyright (c) 2013 | life is good!